# Altium schematic sheet [6] RgbLed.SchDoc
size A3; DocumentNumber: 6; SheetNumber: 6; SheetTotal: 9
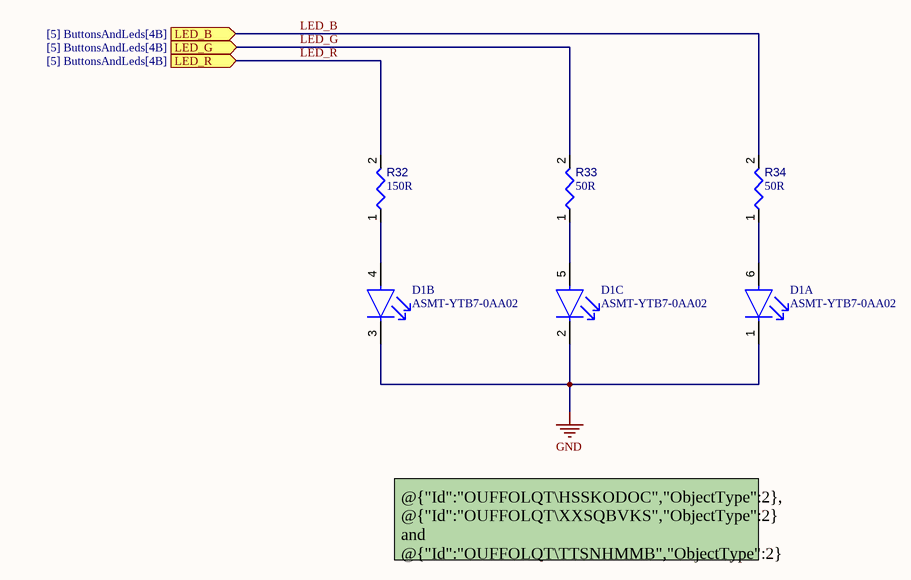
[diagram p0: [6] RgbLed.SchDoc]

## Parts
D1  ASMT-YTB7-0AA02  [FP-PLCC-6-MFG]  (parts A,B,C of 3)
R32  value 150R  [RESC0603(1608)_L]  (hidden comment: CRCW0603150RFKEA)
R33  value 50R  [RESC0603(1608)_L]  (hidden comment: CRCW060350R0FKEA)
R34  value 50R  [RESC0603(1608)_L]  (hidden comment: CRCW060350R0FKEA)

## Ports
LED_B (in, see [5] ButtonsAndLeds[4B]), LED_G (in, see [5] ButtonsAndLeds[4B]), LED_R (in, see [5] ButtonsAndLeds[4B])

## Nets
GND: D1.1(Cathode(Blue)) D1.2(Cathode(Green)) D1.3(Cathode(Red))
LED_B: R34.2 ; port LED_B
LED_G: R33.2 ; port LED_G
LED_R: R32.2 ; port LED_R
NetD1_4: D1.4(Anode(Red)) R32.1
NetD1_5: D1.5(Anode(Green)) R33.1
NetD1_6: D1.6(Anode(Blue)) R34.1

## Notes on the sheet
- @{"Id":"OUFFOLQT\HSSKODOC","ObjectType":2}, @{"Id":"OUFFOLQT\XXSQBVKS","ObjectType":2} and @{"Id":"OUFFOLQT\TTSNHMMB","ObjectType":2} calculated based on voltage drops for each LED for a same current amount of 10mA.
- REVISION
- DESCRIPTION
- DATE
- APPROVED
- ADDRESS
- PROJECT
- VERSION
- TITLE
- A3
- SIZE
- SCALE
- DOCUMENT NAME:
- DOCUMENT REVISION:
- OF
- SHEET:
- PROJECT REVISION:

## Library data of the parts
D1 = CMP-007-00036-1: LED Tri-Color Blue/Green/Red 469nm/529nm/623nm Chip LED 6-Pin PLCC T/R; Lens Size: 2.3mm; Forward Voltage: 3.1V; Lens Transparency: Diffused; Dominant Wavelength: 469nm; Luminous Intensity: 384mcd; Viewing Angle: 120°; Color: Blue,Green,Red; Lens Style: Flat,Square,Diffused,Rectangular; Reverse Voltage: 4V; Number of LEDs: 3; Forward Current: 20mA; Reach SVHC Compliant: No; Case/Package: PLCC; Packaging: Cut Tape; Orientation: Top View; Height: 2mm; Length: 3mm; Contact Plating: Silver; Weight: 40mg; Min Operating Temperature: -40°C; Pins: 6; Series: -; Max Operating Temperature: 100°C; Package Quantity: 2000; Mounting Technology: Surface Mount; Width: 2.8mm; Test Current: 20mA
R32 = CMP-009-00179-1: SMD Chip Resistor, 150 Ohm, ± 1%, 100 mW, 0603 [1608 Metric], Thick Film, General Purpose; Voltage Rating (DC): 75V; Power Rating: 100mW; Temperature Coefficient: 100ppm/°C; Reach SVHC Compliant: Unknown; Height: 0.45mm; Package Quantity: 5000; Technology: THICK FILM; Case Code (Metric): 1608; Weight: 7.1E-05oz; Tolerance: 1%; Max Operating Temperature: 155°C; Military Standard: Not; Series: CRCW; Contact Plating: Tin; Number of Terminations: 2; Ratings: AEC-Q200; Features: Automotive AEC-Q200; Packaging: Tape and Reel; Resistor Type: Thick Film; Construction: Rectangular; Lead Free: Lead Free; Termination: SMD/SMT; Min Operating Temperature: -55°C; Max Power Dissipation: 100mW; Voltage Rating: 75V; Case/Package: 0603; Depth: 0.85mm; Width: 0.85mm; Radiation Hardening: No; Length: 1.55mm; Case Code (Imperial): 0603; RoHS Compliant: Yes; Resistance Tolerance: 1%
R33 R34 = CMP-009-00180-1: SMD Chip Resistor, 50 Ohm, ± 1%, 100 mW, 0603 [1608 Metric], Thick Film, General Purpose; Voltage Rating (DC): 75V; Temperature Coefficient: 100ppm/°C; Max Power Dissipation: 100mW; Termination: SMD/SMT; Height: 0.45mm; Features: Automotive AEC-Q200; Package Quantity: 5000; Max Operating Temperature: 155°C; Pins: 2; Resistance Tolerance: 1%; Depth: 0.85mm; Width: 0.85mm; Contact Plating: Tin; RoHS Compliant: Yes; Case Code (Metric): 1608; Length: 1.55mm; Radiation Hardening: No; Resistor Type: Thick Film; Min Operating Temperature: -55°C; Tolerance: 1%; Reach SVHC Compliant: No; Number of Terminations: 2; Weight: 7.1E-05oz; Packaging: Tape and Reel; Power Rating: 100mW; Case Code (Imperial): 0603; Technology: THICK FILM; Voltage Rating: 75V; Lead Free: Lead Free; Series: CRCW; Case/Package: 0603